# Altium schematic sheet USBPort.SchDoc: USB Port
size A; CompanyName: CUInSpace; DrawnBy: Matteo Golin; Engineer: Matteo Golin; Organization: CUInSpace; Revision: B; SheetNumber: 3; SheetTotal: 4
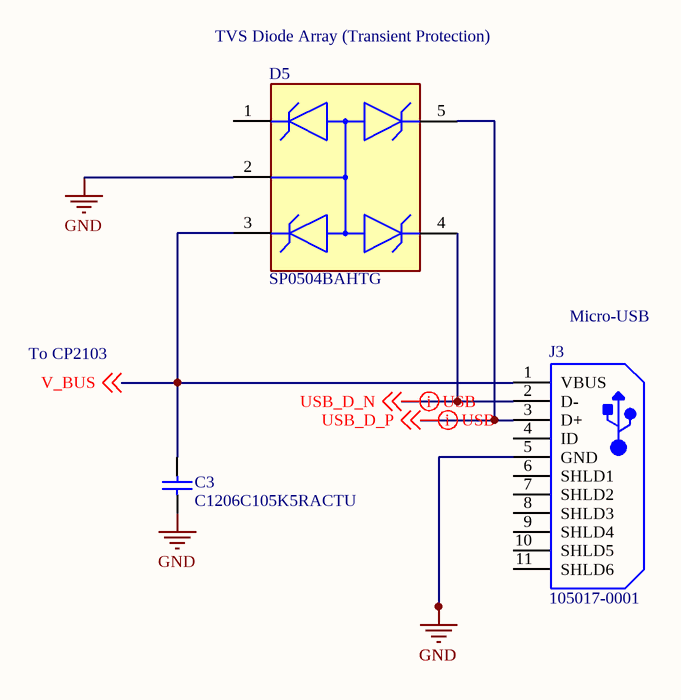
[diagram p0: USBPort.SchDoc]

## Parts
C3  C1206C105K5RACTU  [CAPC3216X110X50LL20T25]
D5  SP0504BAHTG  [FP-SP0504BAHTG-MFG]
J3  105017-0001  [USB-MICRO-B_V]

## Nets
GND: C3.1 D5.2 J3.5(GND)
USB_D_N: D5.4 J3.2(D-) ; off-sheet USB_D_N
USB_D_P: D5.5 J3.3(D+) ; off-sheet USB_D_P
V_BUS: C3.2 D5.3 J3.1(VBUS) ; off-sheet V_BUS

Not connected (* = marked no-connect by the designer): D5 1; J3 4(ID) 6(SHLD1) 7(SHLD2) 8(SHLD3) 9(SHLD4) 10(SHLD5) 11(SHLD6)

## Layout directives
differential pair: USB_D_N, USB_D_P

## Notes on the sheet
- TVS Diode Array (Transient Protection)
- To CP2103
- (near J3) Micro-USB

## Library data of the parts
C3 = CMP-2000-06011-1: Chip Capacitor, 1 uF, +/- 10%, 50 V, -55 to 125 degC, 1206 (3216 Metric), RoHS, Tape and Reel; Manufacturer: Kemet; Case Height: 1mm; Dielectric: X7R; Voltage Rating: 50V; Capacitance: 1uF; Temperature Coefficient / Code: +/-15%; Case Length: 3.2mm; Case Width: 1.6mm; Type: SMDMLCCX7R6.3-250VDCCommericalGrade; Class: Class1; Capacitance - nF: 1000nF; Datasheet URL: http://www.kemet.com/docfinder?Partnumber=C1206C105K5RACTU; Product Category: MultilayerCeramicCapacitorsMLCC-SMD/SMT; Termination Style: SMD/SMT; Dimensions: 1.6mmWx3.2mmLx1mmH; Voltage Rating DC: 50V; Datasheet Version: 02/2016; Packaging: Reel; Brand: Kemet; RoHS: Details; Minimum Operating Temperature: -55C; Operating Temperature Range: -55Cto+125C; Package Reference: 1206; Manufacturer URL: http://www.kemet.com/; Product: GeneralTypeMLCCs; Tolerance: 10%; Package Description: 2-Pin Surface Mount Device, Body 3.2 x 1.6 mm; Mounting Technology: SurfaceMount; Case Code - mm: 3216; Maximum Operating Temperature: +125C; Series: C1206C; Factory Pack Quantity: 2500; Package / Case: 1206(3216metric); Case Code - in: 1206
D5 = CMP-08607-000010-1: TVS DIODE 5.5V 8.5V SOT23-5; Manufacturer: Littelfuse; Direction: Unidirectional; Number Of Channels: 4; Value: 30pF; Standoff Height: 0mm; Mouser Description: TVS Diodes / ESD Suppressors SP0504BAHTG; Device Class L2: TVS Diodes; Manufacturer Part Number: SP0504BAHTG; Category: Diode; Device Class L3: unset; Automotive: No; Lead Free: Yes; Digikey Description: TVS DIODE 5.5V 8.5V SOT23-5; ComponentLink2URL: https://www.littelfuse.com/~/media/electronics/datasheets/tvs_diode_arrays/littelfuse_tvs_diode_array_sp05_datasheet.pdf.pdf; Octopart: https://octopart.com/sp0504bahtg-littelfuse-587259; Temperature Range Low: -40°C; Temperature: -40°C to +125°C; Clamping Voltage: 8.5V; Temperature Range High: +125°C; ComponentLink2Description: Datasheet; Height: 1.45mm; Reverse Standoff Voltage: 5.5V; Device Class L1: Circuit Protection; Package: SP0504BAHTG; Capacitance: 30pF; RoHS: TRUE
J3 = CMP-2000-05827-1: Micro-USB B Receptacle, Right Angle, Bottom Mount, Surface Mount, with Solder Tabs, -30 to 85 degC, 5-Pin USB, RoHS, Tape and Reel; Manufacturer: Molex; Featured Product: Micro-USBConnectorsUSBConnectors; Other Names: WM1399DKR; Package Version: Rev. F, 12/2012; Number of Contacts: 5; Connector Type: USB-microB; Catalog Drawings: 1050170001; 3D Model: 105017-0001.stp; Mating Products: WM17145-ND-CABLEMICROUSBBTOSTDA1.0MWM17147-ND-CABLEMICROUSBBTOSTDA2.0MWM17146-ND-CABLEMICROUSBBTOSTDA1.5M; PCN Assembly/Origin: ResinSupplier21/Oct/2015; Voltage - Max: 30V; Online Catalog: Molex-MicroUSB; Manufacturer URL: http://www.molex.com/; Package Description: 5-Leads USB, Micro B, Body 7.5 x 5 mm, Pitch 0.65 mm; Datasheet URL: http://www.molex.com/elqNow/elqRedir.htm?ref=http://www.molex.com/webdocs/datasheets/pdf/en-us/1050170001_IO_CONNECTORS.pdf; Ingress Protection: -; Datasheet Version: 03/2016; Mounting Type: BoardCutout,SurfaceMount,RightAngle; Circuits: 5; Standard Package: 1; Package Reference: MICRO-B; Package URL: http://www.molex.com/pdm_docs/sd/1050170001_sd.pdf; Category: Connectors,Interconnects; Series: -; RoHS Information: 1050170001CertofCompliance; Features: Shielded,SolderRetention; Family: USB,DVI,HDMIConnectors; Specifications: -; Gender: Receptacle; Packaging: Digi-Reel®; Mounting Technology: SurfaceMount